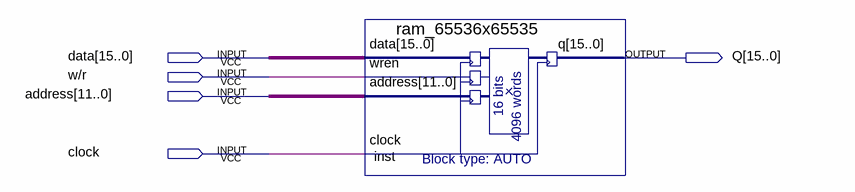
[diagram p0: schematic sheet]
// Quartus schematic ram_2-16x2-16.bdf as structural Verilog: 1 symbols, 5 pins
module \ram_2-16x2-16  (
  input  [15:0] data,
  input  \w/r ,
  input  [11:0] address,
  input  clock,
  output [15:0] Q
);

  ram_65536x65535 inst (.data(data), .wren(\w/r ), .address(address), .clock(clock), .q(Q));
endmodule
